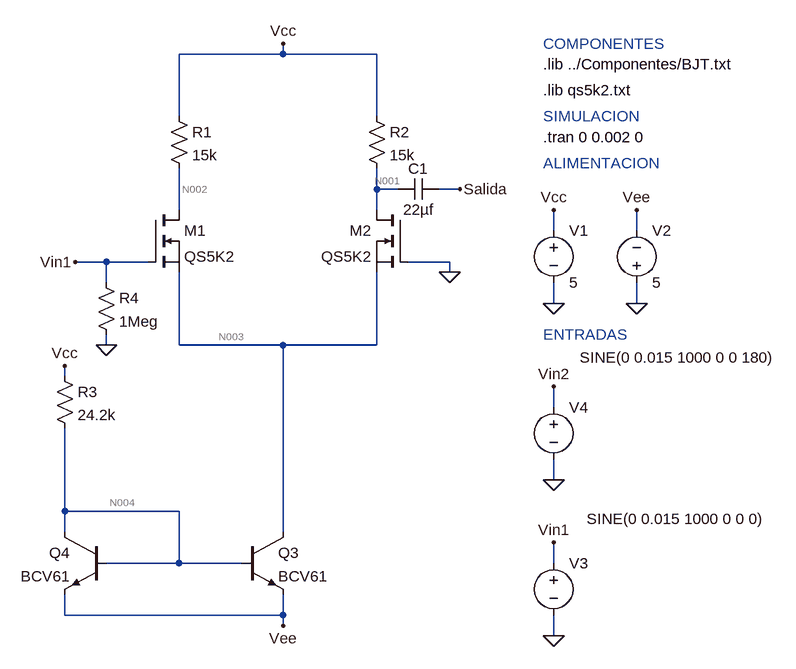
[diagram p0: schematic simulacion.asc]
simulacion.asc, the LTspice schematic file:
Version 4
SHEET 1 1252 872
WIRE 0 -224 0 -240
WIRE 0 -224 -160 -224
WIRE 144 -224 0 -224
WIRE -160 -128 -160 -224
WIRE 144 -128 144 -224
WIRE 144 -16 144 -48
WIRE 176 -16 144 -16
WIRE 272 -16 240 -16
WIRE -160 16 -160 -48
WIRE 144 16 144 -16
WIRE 416 48 416 16
WIRE 544 48 544 16
WIRE -272 96 -320 96
WIRE -208 96 -272 96
WIRE 256 96 192 96
WIRE 256 112 256 96
WIRE -272 128 -272 96
WIRE 416 160 416 128
WIRE 544 160 544 128
WIRE -272 224 -272 208
WIRE -160 224 -160 112
WIRE 0 224 -160 224
WIRE 144 224 144 112
WIRE 144 224 0 224
WIRE -336 272 -336 256
WIRE 416 320 416 288
WIRE 416 432 416 400
WIRE -336 480 -336 352
WIRE -160 480 -336 480
WIRE -336 512 -336 480
WIRE 0 512 0 224
WIRE -160 560 -160 480
WIRE -160 560 -272 560
WIRE -64 560 -160 560
WIRE 416 560 416 528
WIRE -336 640 -336 608
WIRE 0 640 0 608
WIRE 0 640 -336 640
WIRE 0 656 0 640
WIRE 416 672 416 640
FLAG 416 160 0
FLAG 544 160 0
FLAG 416 16 Vcc
FLAG 544 16 Vee
FLAG 0 -240 Vcc
FLAG 416 432 0
FLAG 416 672 0
FLAG 0 656 Vee
FLAG -336 256 Vcc
FLAG -320 96 Vin1
FLAG 416 288 Vin2
FLAG 416 528 Vin1
FLAG -272 224 0
FLAG 256 112 0
FLAG 272 -16 Salida
DATAFLAG 0 336 "Ic(Q3)"
DATAFLAG -160 -176 "I(R1)"
DATAFLAG 144 -176 "I(R2)"
DATAFLAG -336 448 "I(R3)"
SYMBOL voltage 416 32 R0
WINDOW 123 0 0 Left 2
WINDOW 39 0 0 Left 2
SYMATTR InstName V1
SYMATTR Value 5
SYMBOL voltage 544 144 M180
WINDOW 0 24 96 Left 2
WINDOW 3 24 16 Left 2
WINDOW 123 0 0 Left 2
WINDOW 39 0 0 Left 2
SYMATTR InstName V2
SYMATTR Value 5
SYMBOL voltage 416 544 R0
WINDOW 3 51 -52 Left 2
WINDOW 123 0 0 Left 2
WINDOW 39 63 45 Left 2
SYMATTR Value SINE(0 0.015 1000 0 0 0)
SYMATTR InstName V3
SYMBOL voltage 416 304 R0
WINDOW 3 40 -61 Left 2
WINDOW 123 0 0 Left 2
WINDOW 39 63 46 Left 2
SYMATTR Value SINE(0 0.015 1000 0 0 180)
SYMATTR InstName V4
SYMBOL npn -64 512 R0
SYMATTR InstName Q3
SYMATTR Value BCV61
SYMBOL npn -272 512 M0
SYMATTR InstName Q4
SYMATTR Value BCV61
SYMBOL res -352 256 R0
SYMATTR InstName R3
SYMATTR Value 24.2k
SYMBOL nmos -208 16 R0
SYMATTR InstName M1
SYMATTR Value QS5K2
SYMATTR Prefix X
SYMBOL nmos 192 16 M0
SYMATTR InstName M2
SYMATTR Value QS5K2
SYMATTR Prefix X
SYMBOL res -176 -144 R0
SYMATTR InstName R1
SYMATTR Value 15k
SYMBOL res 128 -144 R0
SYMATTR InstName R2
SYMATTR Value 15k
SYMBOL res -288 112 R0
SYMATTR InstName R4
SYMATTR Value 1Meg
SYMBOL cap 240 -32 R90
WINDOW 0 0 32 VBottom 2
WINDOW 3 32 32 VTop 2
SYMATTR InstName C1
SYMATTR Value 22µf
TEXT 400 -208 Left 2 !.lib ../Componentes/BJT.txt
TEXT 400 -96 Left 2 !.tran 0 0.002 0
TEXT 400 -168 Left 2 !.lib qs5k2.txt
TEXT 400 -240 Left 2 ;COMPONENTES
TEXT 400 -128 Left 2 ;SIMULACION
TEXT 400 -56 Left 2 ;ALIMENTACION
TEXT 400 208 Left 2 ;ENTRADAS

The netlist it stands for:
* simulacion.asc
V1 Vcc 0 5
V2 0 Vee 5
V3 Vin1 0 SINE(0 0.015 1000 0 0 0)
V4 Vin2 0 SINE(0 0.015 1000 0 0 180)
Q3 N003 N004 Vee 0 BCV61
Q4 N004 N004 Vee 0 BCV61
R3 Vcc N004 24.2k
XM1 N002 Vin1 N003 QS5K2  ; pins D G S
XM2 N001 0 N003 QS5K2  ; pins D G S
R1 Vcc N002 15k
R2 Vcc N001 15k
R4 Vin1 0 1Meg
C1 Salida N001 22µf
.model NPN NPN
.model PNP PNP
.lib standard.bjt
.lib ../Componentes/BJT.txt
.tran 0 0.002 0
.lib qs5k2.txt
* COMPONENTES
* SIMULACION
* ALIMENTACION
* ENTRADAS
.backanno
.end

* Results of the author's LTspice run, read from the files saved beside the schematic
* Operating Point, zero values left out:
*   V(vcc) = 5 V
*   V(vee) = -5 V
*   V(n003) = -969.1 mV
*   V(n004) = -4.388 V
*   V(n002) = 1.986 V
*   V(n001) = 1.986 V
*   V(salida) = 43.68 µV
*   Ic(Q4) = 385.5 µA
*   Ib(Q4) = 1.241 µA
*   Ie(Q4) = -386.7 µA
*   Ic(Q3) = 401.9 µA
*   Ib(Q3) = 1.241 µA
*   Ie(Q3) = -403.2 µA
*   I(R2) = 201 µA
*   I(R1) = 201 µA
*   I(R3) = 387.9 µA
*   I(V3) = 1.986 pA
*   I(V2) = -789.9 µA
*   I(V1) = -789.9 µA
*   Ix(m1:1) = 201 µA
*   Ix(m1:2) = -1.986 pA
*   Ix(m1:3) = -201 µA
*   Ix(m2:1) = 201 µA
*   Ix(m2:2) = -1.986 pA
*   Ix(m2:3) = -201 µA
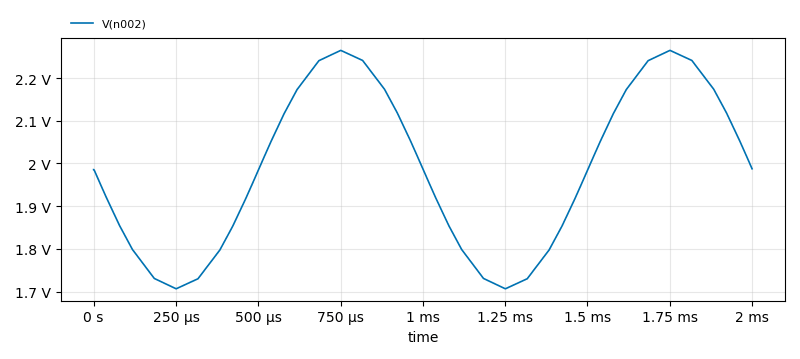
[diagram p1: Transient Analysis of simulacion.asc, plotted from the saved traces]
* Transient Analysis, 1 run:
*   V(n002): min 1.706 V, max 2.265 V, average 1.986 V, rms 1.995 V, last 1.987 V